# EAGLE design settings2 (EAGLE 9.6.2)
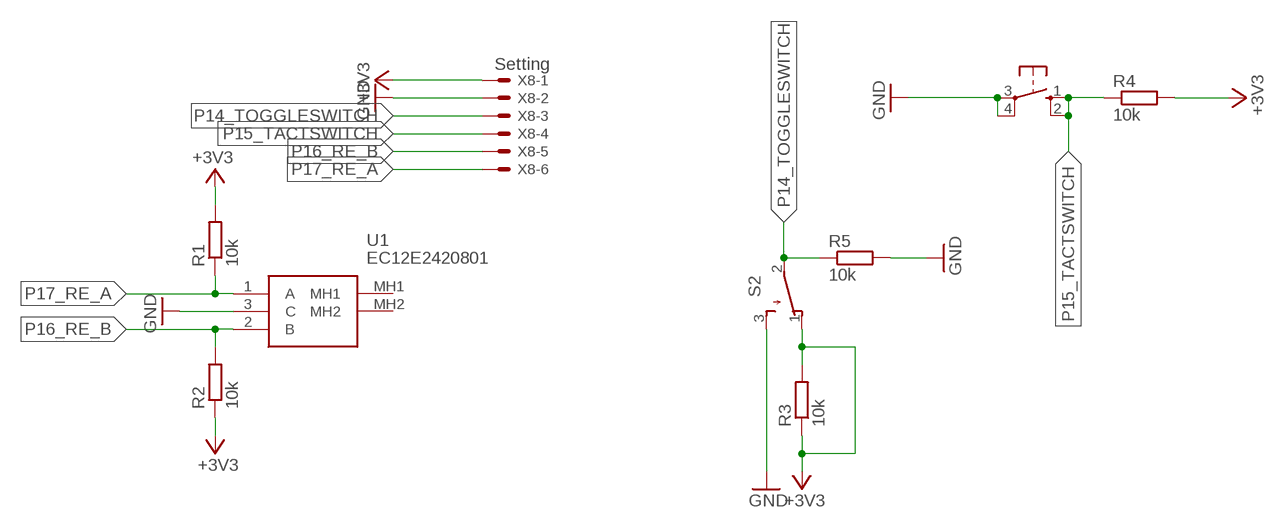
[diagram p0: schematic, sheet 1]

## Parts
R1  10k  R-EU_R0603  [R0603]
R2  10k  R-EU_R0603  [R0603]
R3  10k  R-EU_R0603  [R0603]
R4  10k  R-EU_R0603  [R0603]
R5  10k  R-EU_R0603  [R0603]
S1  40-XX  [B3F-40XX]
S2  TL32PO  [TL3XPO]
U1  EC12E2420801  [EC12E2420801]
X8  Setting  JST-XH-06-PIN-ROUND-PAD  [JST-XH-06-PACKAGE-ROUND-PAD]

## Nets
+3V3: R1.2 R2.1 R3.1 R3.2 R4.2 S2.1(O) X8.1
GND: R5.2 S1.3(P) S1.4(P1) S2.3(S) U1.3(C) X8.2
P14_TOGGLESWITCH: R5.1 S2.2(P) X8.3
P15_TACTSWITCH: R4.1 S1.1(S) S1.2(S1) X8.4
P16_RE_B: R2.2 U1.2(B) X8.5
P17_RE_A: R1.1 U1.1(A) X8.6
Unconnected: U1.MH1 U1.MH2

## Library data of the parts
R1-R5 = rcl:R-EU_: RESISTOR, European symbol; SPICEPREFIX: R
S1 = switch-omron:40-XX: OMRON SWITCH; MF: OMRON COMPONENTS USA; MPN: B3F-4000; OC_FARNELL: 176434; OC_NEWARK: 36K3105
S2 = switch:TL32PO: TINY SWITCH ON - MOM Source: http://www2.produktinfo.conrad.com/datenblaetter/700000-724999/705152-da-01-de-Subminiaturschalter_TL_36YO.pdf
U1 = EC12E2420801:EC12E2420801: Alps 24 Pulse Incremental Mechanical Rotary Encoder with a 6 mm Flat Shaft (Not Indexed), Through Hole Source: Datasheet <http://uk.rs-online.com/web/p/products/7295836>; ALLIED_NUMBER: R1076112; DESCRIPTION: Alps 24 Pulse Incremental Mechanical Rotary Encoder with a 6 mm Flat Shaft (Not Indexed), Through Hole; HEIGHT: 25mm; MANUFACTURER_NAME: ALPS Electric; MANUFACTURER_PART_NUMBER: EC12E2420801; RS_PART_NUMBER: 7295836; RS_PRICE-STOCK: http://uk.rs-online.com/web/p/products/7295836
X8 = JST XH Connectors v1-0:JST-XH-06-PIN: JST XH Connector 2 Pin Wire to board connector. Pitch: 2,54 mm, (0.100") Number of pins: 6 Created by Rembrandt Electronics www.rembrandtelectronics.com

## Board
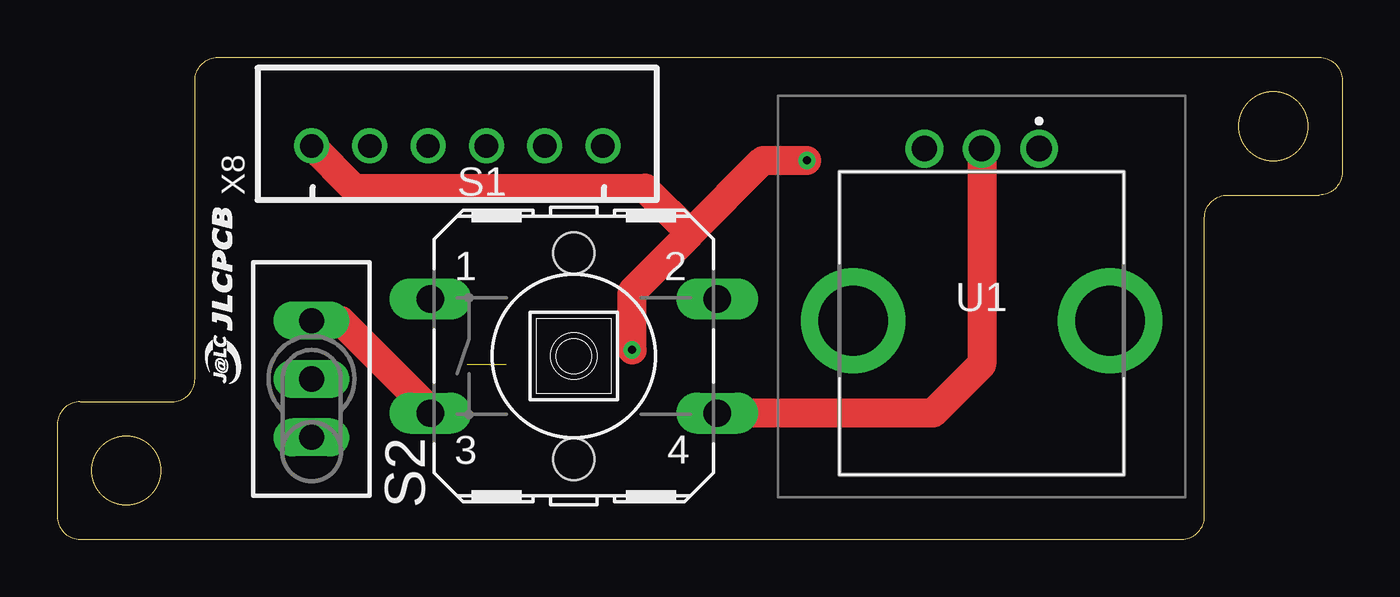
[diagram p1: board, top side]
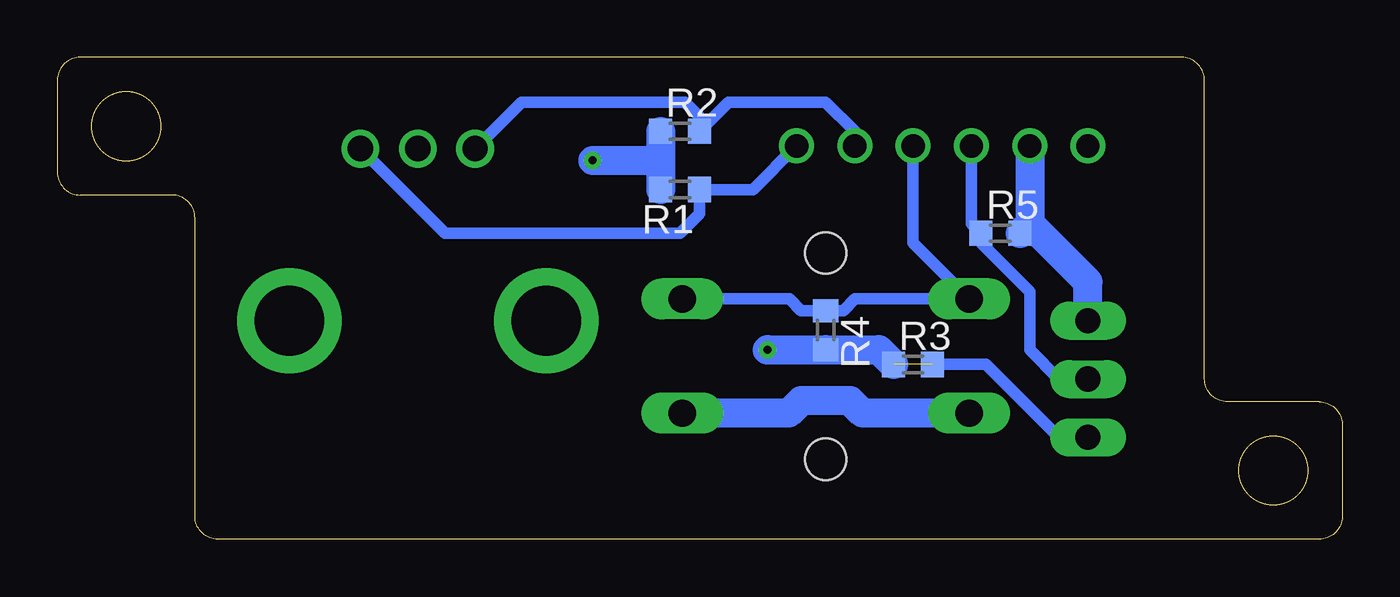
[diagram p2: board, bottom side, seen from below]

Size 56 x 21 mm. Coordinates in mm from the lower left corner, seen from the top.
Outline: 1,6 arc90 0,5 0,1 arc90 1,0 49,0 arc90 50,1 50,14 arc-90 51,15 55,15 arc90 56,16 56,20 arc90 55,21 7,21 arc90 6,20 6,7 arc-90 5,6 1,6
Outline: circle at 53,18 radius 1.5
Outline: circle at 3,3 radius 1.5
Copper layers (1*16): Top 0.035mm / dielectric 1.5mm / Bottom 0.035mm
Design rules "default": minimum track width 6mil, minimum drill 0.35mm, track to track 6mil, track to pad 6mil, pad to pad 6mil, via to via 6mil, smd to smd 6mil, copper to edge 40mil, drill to drill 6mil, minimum pad ring 10mil, minimum via ring 8mil, stop-mask expansion 4mil, vias tented up to drill 0mil, thermal gap 10mil

### Footprints (pad centres in the part's own frame; a part is rotated, then mirrored left to right if it is on the bottom)
R0603 = smd 1 x 1.1: 1 -0.85,0; 2 0.85,0
B3F-40XX = drill 1.194 long: 1 -6.248,2.489; 2 6.248,2.489; 3 -6.248,-2.489; 4 6.248,-2.489 | hole 1.803: 0,-4.496; 0,4.496
TL3XPO = drill 1.1 pad 1.422 long: 1 -2.54,0; 2 0,0; 3 2.54,0
EC12E2420801 = drill 1.1 pad 1.65: 1 -2.5,-7.5; 2 2.5,-7.5; 3 0,-7.5 | drill 3.041 pad 4.562: MH1 -5.6,0; MH2 5.6,0
JST-XH-06-PACKAGE-ROUND-PAD = drill 1.016: 1 -6.35,0; 2 -3.81,0; 3 -1.27,0; 4 1.27,0; 5 3.81,0; 6 6.35,0

### Placement (x,y rotation side)
R1  28.86,15.24 180 bottom
R2  28.86,17.78 0 bottom
R3  18.7,7.62 0 bottom
R4  22.51,9.12 270 bottom
R5  14.89,13.34 0 bottom
S1  22.51,7.99 0 top
S2  11.08,6.99 90 top
U1  40.29,9.53 180 top
X8  17.43,17.14 0 top

### Tracks (layer width: path | path; a pad name or v marks a point on that pad's centre or on a via)
+3V3  (via drill 0.35)  (1 unrouted)
  Top 1.27: v25.05,8.26 25.05,10.79 27.59,13.34 | 27.59,13.34 30.77,16.51 v32.67,16.51 | X8.1 12.92,15.3 25.62,15.3 27.59,13.34
  Bottom 0.508: S2.1 12.35,4.45 15.53,7.62 R3.2
  Bottom 1.27: R3.1 20.2,8.27 R4.2 25.04,8.27 v25.05,8.26 | R2.1 29.71,16.51 | 29.71,16.51 R1.2 | v32.67,16.51 29.71,16.51
GND
  Top 1.27: S2.3 12.35,9.53 16.26,5.61 S1.3 | U1.3 40.29,7.62 38.17,5.5 S1.4
  Bottom 1.27: X8.2 13.62,13.76 | 13.62,13.76 R5.2 | S2.3 11.08,11.21 13.62,13.76 | S1.3 20.91,5.5 21.45,6.04 23.57,6.04 24.11,5.5 S1.4
P14_TOGGLESWITCH
  Bottom 0.508: S2.2 12.35,6.99 13.62,8.26 13.62,10.79 15.74,12.91 R5.1 16.16,13.76 X8.3
P15_TACTSWITCH
  Bottom 0.508: X8.4 18.7,12.91 S1.1 21.24,10.47 21.74,9.97 R4.1 23.59,9.97 24.09,10.47 S1.2
P16_RE_B
  Bottom 0.508: U1.2 35.77,19.05 28.64,19.05 28.01,18.41 R2.2 26.74,19.05 22.51,19.05 21.24,17.78 X8.5
P17_RE_A
  Bottom 0.508: X8.6 25.68,15.24 R1.1 28.01,14.19 28.86,13.34 39.1,13.34 U1.1

### Text on the board
tNames: C:/Users/white/OneDrive/デスクトップ/回路/JLCPCB.bmp